# Altium schematic sheet LPC1768_2.SchDoc: LPC1768
size 298 x 212 mm; Date: 02.08.2016 15:40:22; SheetNumber: 3
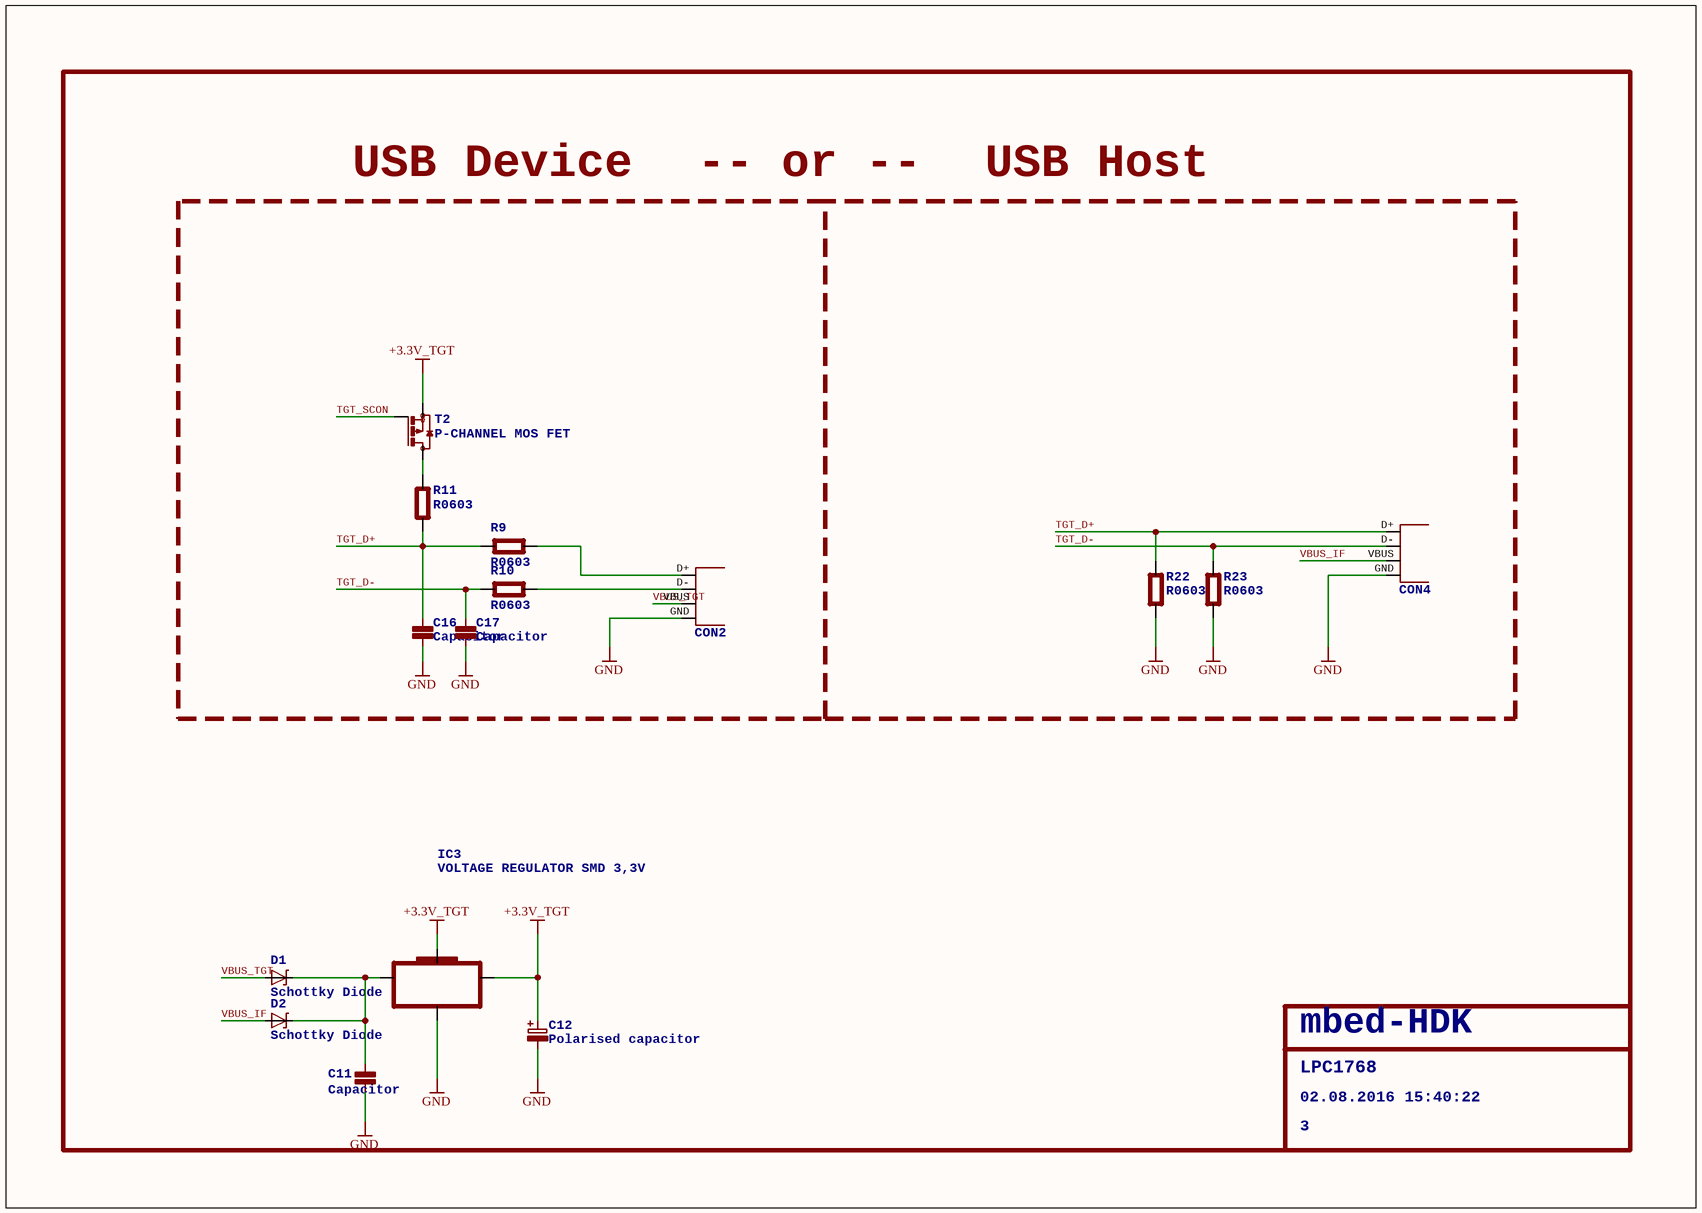
[diagram p0: LPC1768_2.SchDoc]

## Parts
C11  Capacitor  [0603]
C12  Polarised capacitor  [CASE-B]
C16  Capacitor  [0603]
C17  Capacitor  [0603]
CON2  USB Connectors  [USB-MB-S]  (value not drawn)
CON4  USB Connectors  [USB-A-H]  (value not drawn)
D1  Schottky Diode  [BAT60A]
D2  Schottky Diode  [BAT60A]
IC3  VOLTAGE REGULATOR SMD 3,3V  [SOT223]
R9  R0603  [0603]
R10  R0603  [0603]
R11  R0603  [0603]
R22  R0603  [0603]
R23  R0603  [0603]
T2  P-CHANNEL MOS FET  [SOT23]

## Nets
+3.3V_TGT: C12.1 IC3.2(OUT) IC3.4(K) T2.2(S)
GND: C11.2(P$2) C12.2 C16.2(P$2) C17.2(P$2) CON2.GND CON4.GND IC3.1(GND) R22.1(P$1) R23.1(P$1)
TGT_D+: C16.1(P$1) CON4.D+ R9.1(P$1) R11.2(P$2) R22.2(P$2)
TGT_D-: C17.1(P$1) CON4.D- R10.1(P$1) R23.2(P$2)
TGT_SCON: T2.1(G)
VBUS_IF: CON4.VBUS D2.A
VBUS_TGT: CON2.VBUS D1.A
NetC11_1: C11.1(P$1) D1.K D2.K IC3.3(IN)
NetCON2_D+: CON2.D+ R9.2(P$2)
NetCON2_D-: CON2.D- R10.2(P$2)
NetR11_1: R11.1(P$1) T2.3(D)

## Notes on the sheet
- USB Device
- -- or --
- USB Host
- LPC1768
- mbed-HDK
- 02.08.2016 15:40:22
- 3

## Library data of the parts
C11 C16 C17 = C0603
C12 = C-POLB
CON2 = USB-MB-S
CON4 = USB-A-H
D1 D2 = BAT60A
IC3 = LD1117S33
T2 = BSS84